# Altium project WUT-4-3-3.PrjPCB
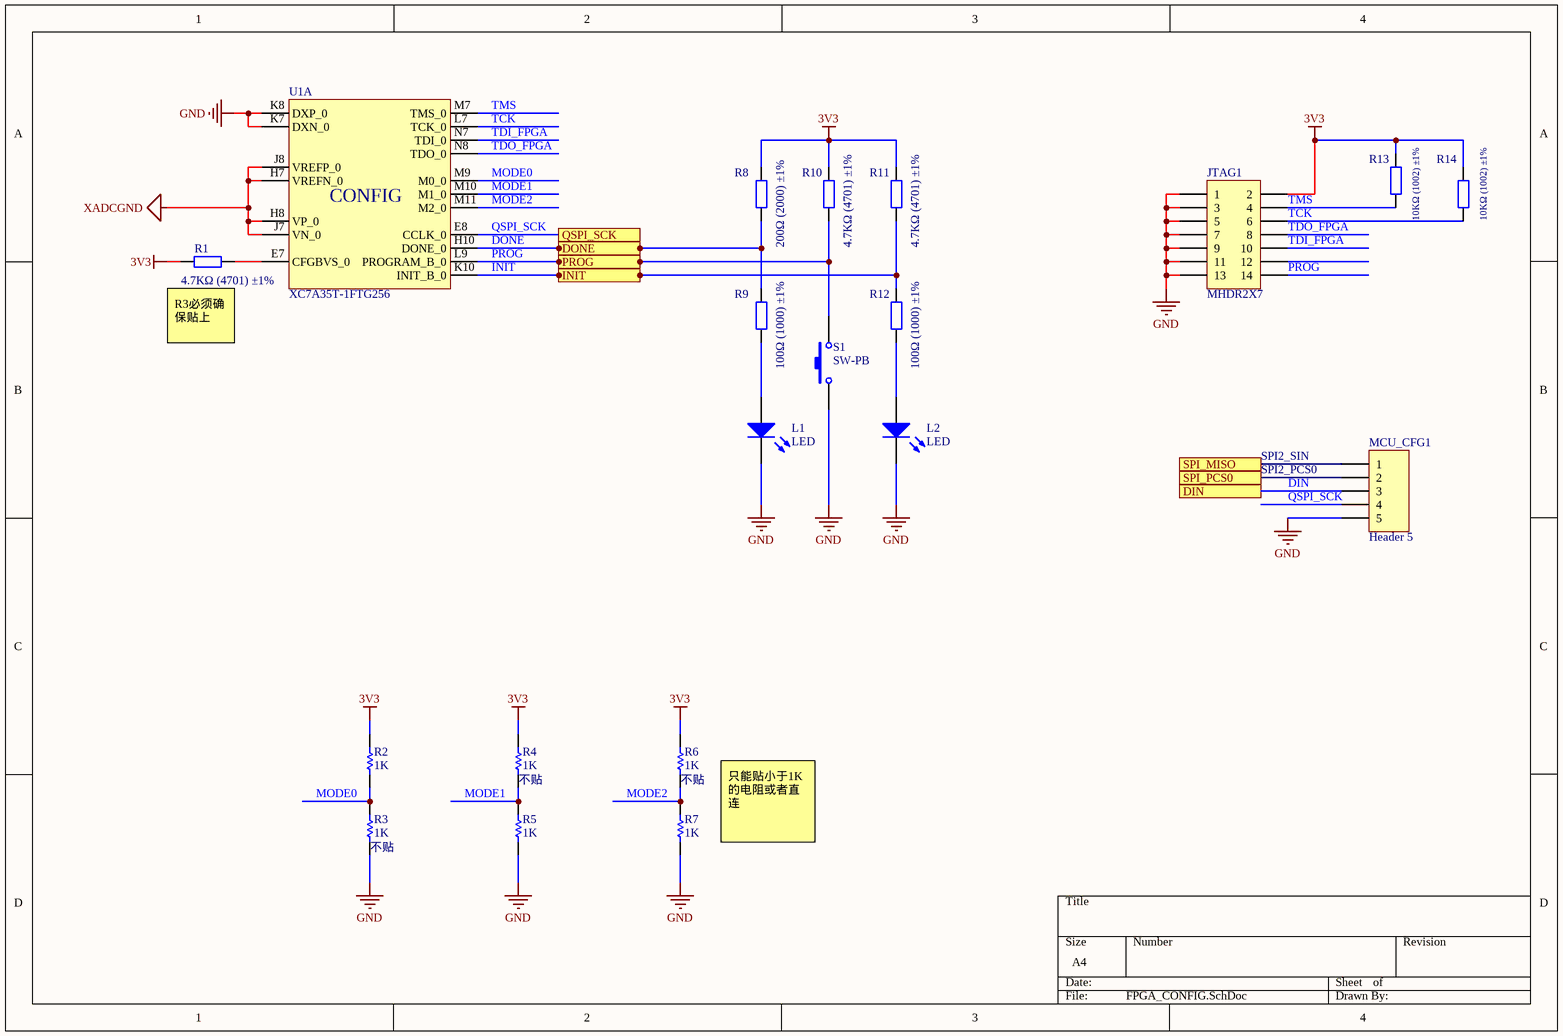
[diagram p0: FPGA_CONFIG.SchDoc]
4 sheets, 143 parts. Net scope: flat (ports and power ports of the same name join across sheets).
Board files: YJ-4-3-2.PcbDoc, WUT-4-3-3.PcbDoc
Sheets:
  FPGA_CONFIG.SchDoc
  GENERAL-IO.SchDoc
  POWER.SchDoc
  FPGA_POWER.SchDoc

## Sheet FPGA_CONFIG.SchDoc
size A4

### Parts
JTAG1  MHDR2X7  [Hearder2 7X2]
L1  LED  [1608[0603]]
L2  LED  [1608[0603]]
MCU_CFG1  Header 5  [MHDR1X5]
R1  4.7KΩ (4701) ±1%  [0402_R]
R2  value 1K  [1608[0603]]  (hidden comment: Res)
R3  不贴  value 1K  [1608[0603]]
R4  不贴  value 1K  [1608[0603]]
R5  value 1K  [1608[0603]]  (hidden comment: Res)
R6  不贴  value 1K  [1608[0603]]
R7  value 1K  [1608[0603]]  (hidden comment: Res)
R8  200Ω (2000) ±1%  [0402_R]
R9  100Ω (1000) ±1%  [0402_R]
R10  4.7KΩ (4701) ±1%  [0402_R]
R11  4.7KΩ (4701) ±1%  [0402_R]
R12  100Ω (1000) ±1%  [0402_R]
R13  10KΩ (1002) ±1%  [0402_R]
R14  10KΩ (1002) ±1%  [0402_R]
S1  SW-PB  [key 3*4*2]
U1  XC7A35T-1FTG256  [BGA100P9X9-81A]  (part A of 7)

### Ports
DIN, DONE, INIT, PROG, QSPI_SCK, SPI_MISO, SPI_PCS0

### Nets
3V3: JTAG1.2 R1.1 R2.2 R4.2 R6.2 R8.2 R10.2 R11.2 R13.2 R14.2
GND: JTAG1.1 JTAG1.3 JTAG1.5 JTAG1.7 JTAG1.9 JTAG1.11 JTAG1.13 L1.2(K) L2.2(K) MCU_CFG1.5 R3.1 R5.1 R7.1 S1.1 U1.K7(DXN_0) U1.K8(DXP_0)
XADCGND: U1.H7(VREFN_0) U1.H8(VP_0) U1.J7(VN_0) U1.J8(VREFP_0)
DIN: MCU_CFG1.3 ; port DIN
DONE: R8.1 R9.2 U1.H10(DONE_0) ; port DONE
INIT: R11.1 R12.2 U1.K10(INIT_B_0) ; port INIT
MODE0: R2.1 R3.2 U1.M9(M0_0)
MODE1: R4.1 R5.2 U1.M10(M1_0)
MODE2: R6.1 R7.2 U1.M11(M2_0)
PROG: JTAG1.14 R10.1 S1.2 U1.L9(PROGRAM_B_0) ; port PROG
QSPI_SCK: MCU_CFG1.4 U1.E8(CCLK_0) ; port QSPI_SCK
SPI2_PCS0: MCU_CFG1.2 ; port SPI_PCS0
SPI2_SIN: MCU_CFG1.1 ; port SPI_MISO
TCK: JTAG1.6 R14.1 U1.L7(TCK_0)
TDI_FPGA: JTAG1.10 U1.N7(TDI_0)
TDO_FPGA: JTAG1.8 U1.N8(TDO_0)
TMS: JTAG1.4 R13.1 U1.M7(TMS_0)
NetL1_1: L1.1(A) R9.1
NetL2_1: L2.1(A) R12.1
NetR1_2: R1.2 U1.E7(CFGBVS_0)

Not connected (* = marked no-connect by the designer): JTAG1 12

### Notes on the sheet
- (near R1) R3必须确保贴上
- 只能贴小于1K的电阻或者直连
- (in symbol XC7A35T-1FTG256, part A) CONFIG

### Library data of the parts
JTAG1 = MHDR2X7: Header, 7-Pin, Dual row; LatestRevisionDate: 17-Jul-2002; LatestRevisionNote: Re-released for DXP Platform.; Publisher: Altium Limited
MCU_CFG1 = Header 5: Header, 5-Pin; LatestRevisionDate: 17-Jul-2002; LatestRevisionNote: Re-released for DXP Platform.; Publisher: Altium Limited
R1 R10 R11 = 0402 4.7KΩ (4701) 1%: 贴片电阻; ComponentLink1Description: 供应商链接; ComponentLink1URL: http://www.szlcsc.com/product/details_26643.html; Package: 0402; Supplier: LC; SuppliersPartNumber: C25900
R2-R7 = Res: 贴片电阻; Published: 8-Jun-2000; LatestRevisionDate: 17-Jul-2002; LatestRevisionNote: Re-released for DXP Platform.; PackageReference: AXIAL-0.3; Publisher: Altium Limited
R8 = 0402 200Ω (2000) 1%: 贴片电阻; ComponentLink1Description: 供应商链接; ComponentLink1URL: http://www.szlcsc.com/product/details_25830.html; Package: 0402; Supplier: LC; SuppliersPartNumber: C25087
R9 R12 = 0402 100Ω (1000) 1%: 贴片电阻; ComponentLink1Description: 供应商链接; ComponentLink1URL: http://www.szlcsc.com/product/details_25819.html; Package: 0402; Supplier: LC; SuppliersPartNumber: C25076
R13 R14 = 0402 10KΩ (1002) 1%: 贴片电阻; ComponentLink1Description: 供应商链接; ComponentLink1URL: http://www.szlcsc.com/product/details_26487.html; Package: 0402; Supplier: LC; SuppliersPartNumber: C25744
S1 = SW-PB: Switch; Published: 24-Mar-1999; LatestRevisionDate: 17-Jul-2002; LatestRevisionNote: Re-released for DXP Platform.; PackageReference: SPST-2; Publisher: Altium Limited; PackageDescription: Switch; 2 Leads

## Sheet GENERAL-IO.SchDoc
size A3
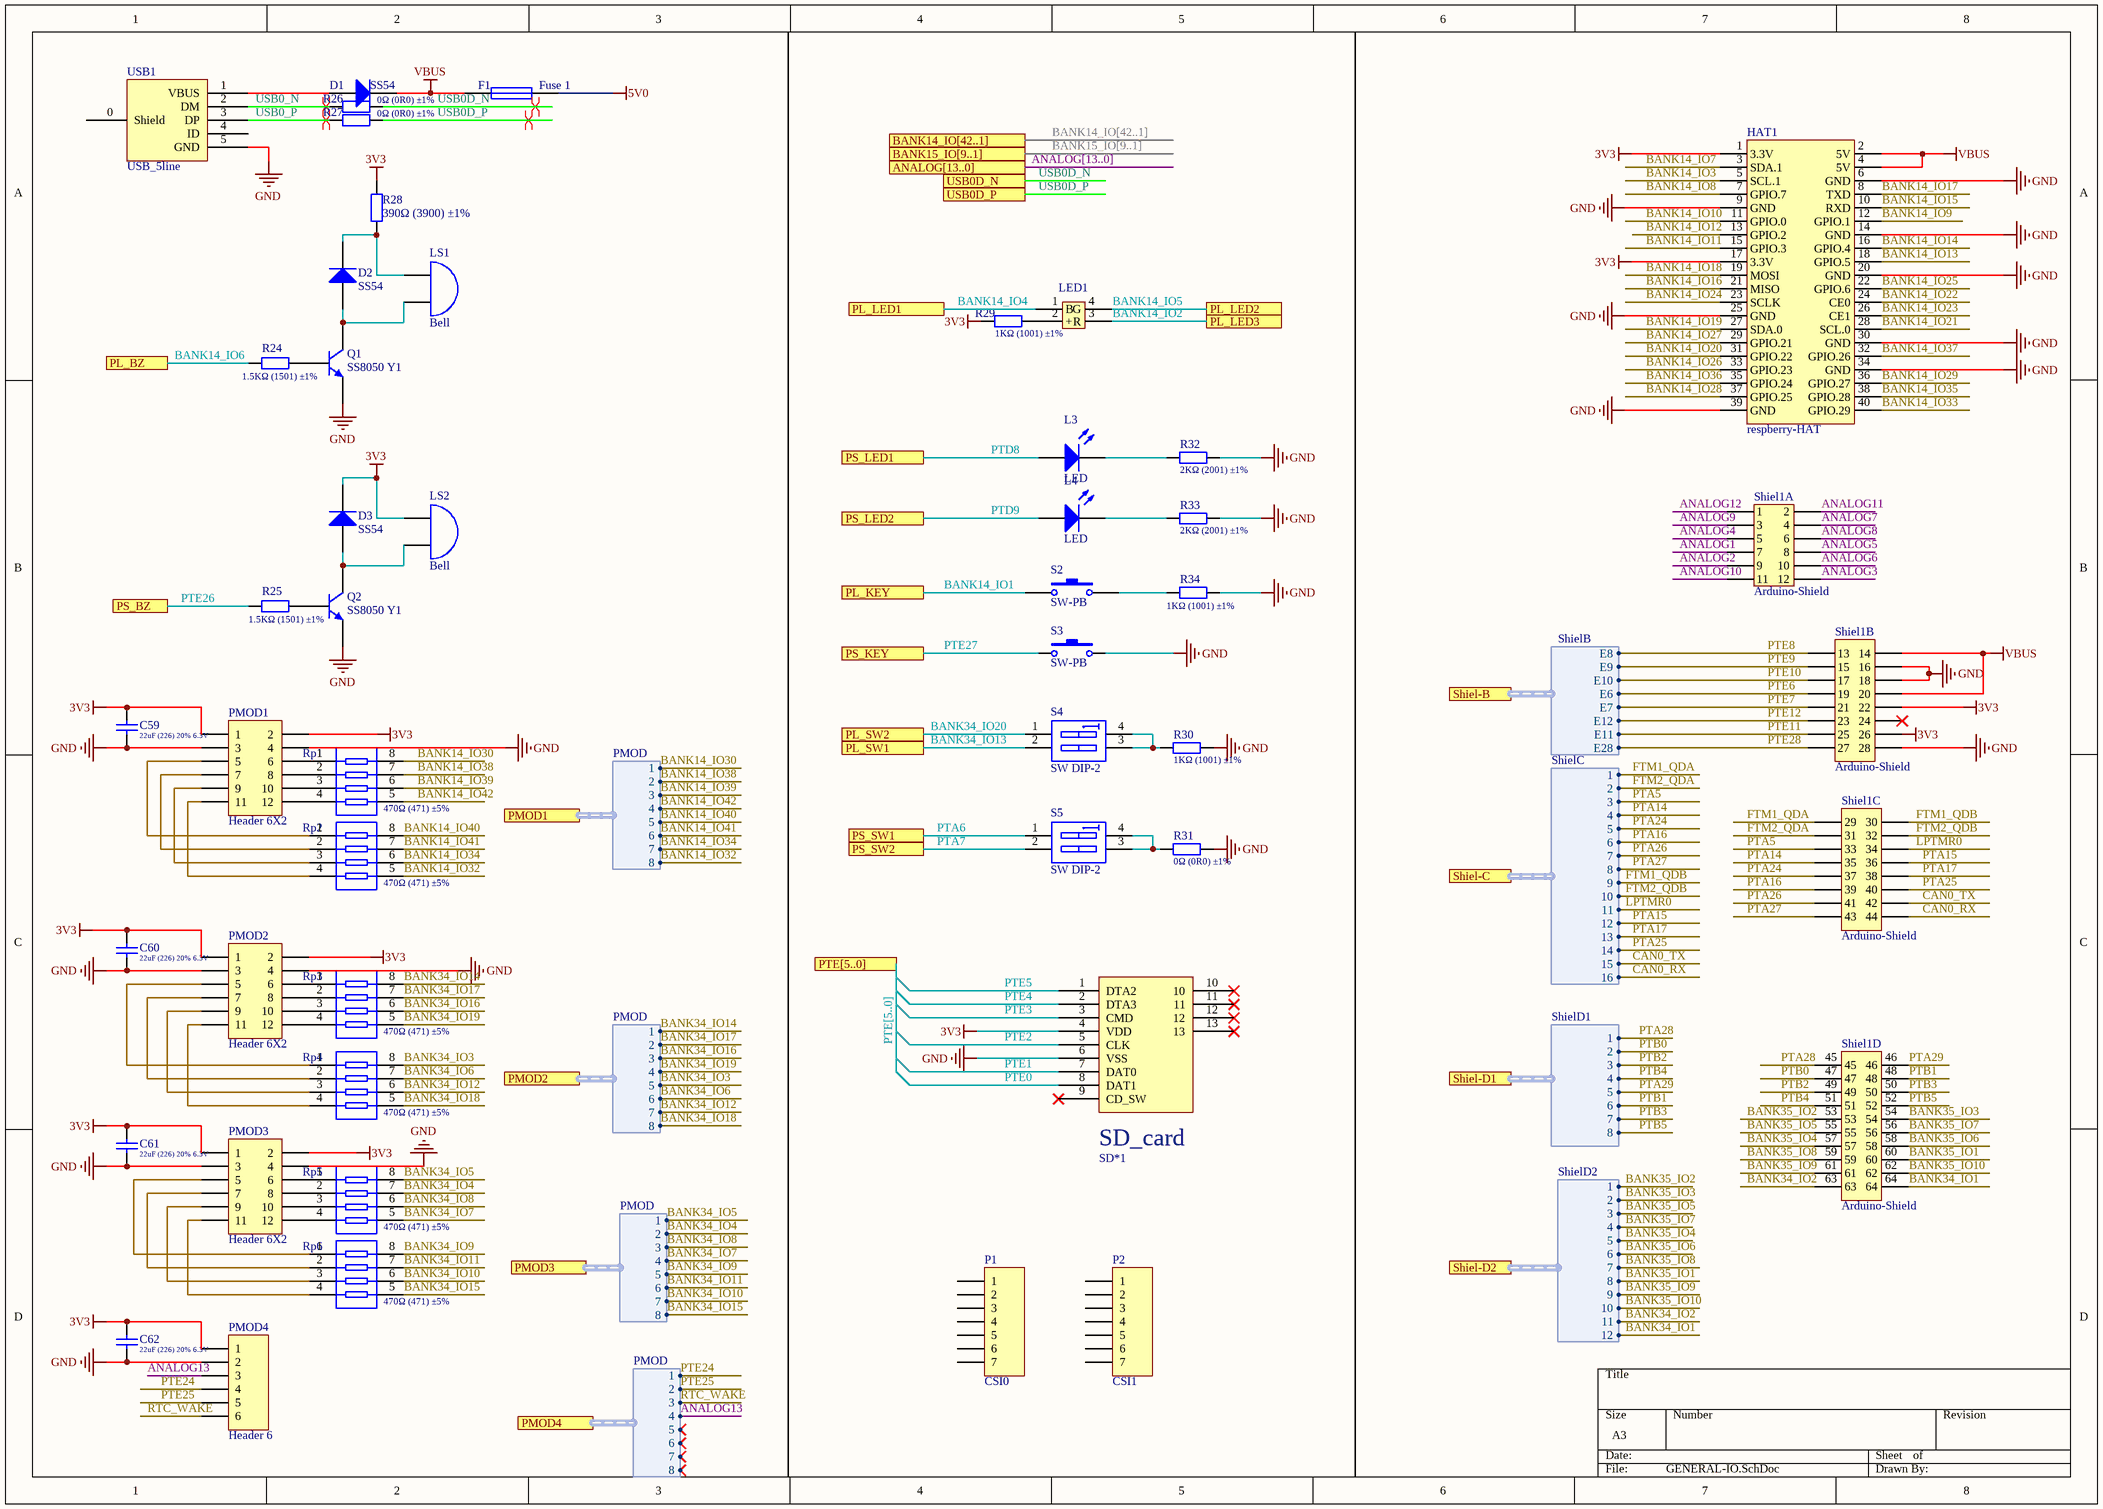
[diagram p1: GENERAL-IO.SchDoc]

### Parts
(Parts that share a designator on the sheet are numbered #1, #2 ... from top to bottom, then left to right.)
C59#1  22uF (226) 20% 6.3V  [0603_C]
C60#1  22uF (226) 20% 6.3V  [0603_C]
C61#1  22uF (226) 20% 6.3V  [0603_C]
C62  22uF (226) 20% 6.3V  [0603_C]
D1  SS54  [SMA(DO-214AC)_S1]
D2  SS54  [SMA(DO-214AC)_S1]
D3#1  SS54  [SMA(DO-214AC)_S1]
F1  Fuse 1  [1206]
HAT1  respberry-HAT  [SMT-HAT]
L3#1  LED  [1608[0603]]
L4#1  LED  [1608[0603]]
LED1  RGB_LED1206  [RGB]  (value not drawn)
LS1  Bell  [MLT-5020 BZ]
LS2  Bell  [BZ]
P1  CSI0
P2  CSI1
PMOD1  Header 6X2  [HDR2X6]
PMOD2  Header 6X2  [HDR2X6]
PMOD3  Header 6X2  [HDR2X6]
PMOD4  Header 6  [HDR1X6]
Q1  SS8050 Y1  [SOT-23(SOT-23-3)]
Q2  SS8050 Y1  [SOT-23(SOT-23-3)]
R24  1.5KΩ (1501) ±1%  [0402_R]
R25  1.5KΩ (1501) ±1%  [0402_R]
R26  0Ω (0R0) ±1%  [0402_R]
R27  0Ω (0R0) ±1%  [0402_R]
R28  390Ω (3900) ±1%  [0805_R]
R29#1  1KΩ (1001) ±1%  [0402_R]
R30#1  1KΩ (1001) ±1%  [0402_R]
R31#1  0Ω (0R0) ±1%  [0402_R]
R32#1  2KΩ (2001) ±1%  [0402_R]
R33#1  2KΩ (2001) ±1%  [0402_R]
R34#1  1KΩ (1001) ±1%  [0402_R]
Rp1  470Ω (471) ±5%  [0603_Rx4]
Rp2  470Ω (471) ±5%  [0603_Rx4]
Rp3  470Ω (471) ±5%  [0603_Rx4]
Rp4  470Ω (471) ±5%  [0603_Rx4]
Rp5  470Ω (471) ±5%  [0603_Rx4]
Rp6  470Ω (471) ±5%  [0603_Rx4]
S2  SW-PB  [key 3*4*2]
S3  SW-PB  [key 3*4*2]
S4  SW DIP-2  [sw*2]
S5  SW DIP-2  [sw*2]
SD*1  TF_card  [TF卡座(短体)]  (value not drawn)
Shiel1  Arduino-Shield  [SMT-B-Shield]  (parts A,B,C,D of 4)
USB1  USB_5line  [USB-MICRO-5P-2F]

### Ports
ANALOG[13..0] (harness Flexbus), BANK14_IO[42..1], BANK15_IO[9..1], PL_BZ, PL_KEY, PL_LED1, PL_LED2, PL_LED3, PL_SW1, PL_SW2, PMOD1 (harness PMOD), PMOD2 (harness PMOD), PMOD3 (harness PMOD), PMOD4 (harness PMOD), PS_BZ, PS_KEY, PS_LED1, PS_LED2, PS_SW1, PS_SW2, PTE[5..0], Shiel-B (harness ShielB), Shiel-C (harness ShielC), Shiel-D1 (harness ShielD1), Shiel-D2 (harness ShielD2), USB0D_N, USB0D_P

### Harnesses
ShielB: E8, E9, E10, E6, E7, E12, E11, E28
PMOD: 1, 2, 3, 4, 5, 6, 7, 8
ShielC: 1, 2, 3, 4, 5, 6, 7, 8, 9, 10, 11, 12, 13, 14, 15, 16
ShielD1: 1, 2, 3, 4, 5, 6, 7, 8
ShielD2: 1, 2, 3, 4, 5, 6, 7, 8, 9, 10, 11, 12

### Nets
3V3: C59#1.2 C60#1.2 C61#1.2 C62.2 D3#1.2(K) HAT1.1(3.3V) HAT1.17(3.3V) LS2.1(A) PMOD1.1 PMOD1.2 PMOD2.1 PMOD2.2 PMOD3.1 PMOD3.2 PMOD4.1 R28.2 R29#1.1 SD*1.4(VDD) Shiel1.22 Shiel1.26
5V0: F1.1
GND: C59#1.1 C60#1.1 C61#1.1 C62.1 HAT1.6(GND) HAT1.9(GND) HAT1.14(GND) HAT1.20(GND) HAT1.25(GND) HAT1.30(GND) HAT1.34(GND) HAT1.39(GND) PMOD1.3 PMOD1.4 PMOD2.3 PMOD2.4 PMOD3.3 PMOD3.4 PMOD4.2 Q1.2(E) Q2.2(E) R30#1.2 R31#1.2 R32#1.2 R33#1.2 R34#1.2 S3.2 SD*1.6(VSS) Shiel1.16 Shiel1.18 Shiel1.28 USB1.5(GND)
VBUS: D1.2(K) F1.2 HAT1.2(5V) HAT1.4(5V) Shiel1.14 Shiel1.20
ANALOG1: Shiel1.7
ANALOG2: Shiel1.9
ANALOG3: Shiel1.12
ANALOG4: Shiel1.5
ANALOG5: Shiel1.8
ANALOG6: Shiel1.10
ANALOG7: Shiel1.4
ANALOG8: Shiel1.6
ANALOG9: Shiel1.3
ANALOG10: Shiel1.11
ANALOG11: Shiel1.2
ANALOG12: Shiel1.1
ANALOG13: PMOD4.3 ; port PMOD4.4
BANK14_IO1: S2.1 ; port PL_KEY
BANK14_IO2: LED1.3(R) ; port PL_LED3
BANK14_IO3: HAT1.5(SCL.1)
BANK14_IO4: LED1.1(B) ; port PL_LED1
BANK14_IO5: LED1.4(G) ; port PL_LED2
BANK14_IO6: R24.1 ; port PL_BZ
BANK14_IO7: HAT1.3(SDA.1)
BANK14_IO8: HAT1.7(GPIO.7)
BANK14_IO9: HAT1.12(GPIO.1)
BANK14_IO10: HAT1.11(GPIO.0)
BANK14_IO11: HAT1.15(GPIO.3)
BANK14_IO12: HAT1.13(GPIO.2)
BANK14_IO13: HAT1.18(GPIO.5)
BANK14_IO14: HAT1.16(GPIO.4)
BANK14_IO15: HAT1.10(RXD)
BANK14_IO16: HAT1.21(MISO)
BANK14_IO17: HAT1.8(TXD)
BANK14_IO18: HAT1.19(MOSI)
BANK14_IO19: HAT1.27(SDA.0)
BANK14_IO20: HAT1.31(GPIO.22)
BANK14_IO21: HAT1.28(SCL.0)
BANK14_IO22: HAT1.24(CE0)
BANK14_IO23: HAT1.26(CE1)
BANK14_IO24: HAT1.23(SCLK)
BANK14_IO25: HAT1.22(GPIO.6)
BANK14_IO26: HAT1.33(GPIO.23)
BANK14_IO27: HAT1.29(GPIO.21)
BANK14_IO28: HAT1.37(GPIO.25)
BANK14_IO29: HAT1.36(GPIO.27)
BANK14_IO30: Rp1.8 ; port PMOD1.1
BANK14_IO32: Rp2.5 ; port PMOD1.8
BANK14_IO33: HAT1.40(GPIO.29)
BANK14_IO34: Rp2.6 ; port PMOD1.7
BANK14_IO35: HAT1.38(GPIO.28)
BANK14_IO36: HAT1.35(GPIO.24)
BANK14_IO37: HAT1.32(GPIO.26)
BANK14_IO38: Rp1.7 ; port PMOD1.2
BANK14_IO39: Rp1.6 ; port PMOD1.3
BANK14_IO40: Rp2.8 ; port PMOD1.5
BANK14_IO41: Rp2.7 ; port PMOD1.6
BANK14_IO42: Rp1.5 ; port PMOD1.4
BANK34_IO1: Shiel1.64 ; port Shiel-D2.12
BANK34_IO2: Shiel1.63 ; port Shiel-D2.11
BANK34_IO3: Rp4.8 ; port PMOD2.5
BANK34_IO4: Rp5.7 ; port PMOD3.2
BANK34_IO5: Rp5.8 ; port PMOD3.1
BANK34_IO6: Rp4.7 ; port PMOD2.6
BANK34_IO7: Rp5.5 ; port PMOD3.4
BANK34_IO8: Rp5.6 ; port PMOD3.3
BANK34_IO9: Rp6.8 ; port PMOD3.5
BANK34_IO10: Rp6.6 ; port PMOD3.7
BANK34_IO11: Rp6.7 ; port PMOD3.6
BANK34_IO12: Rp4.6 ; port PMOD2.7
BANK34_IO13: S4.2(A2) ; port PL_SW1
BANK34_IO14: Rp3.8 ; port PMOD2.1
BANK34_IO15: Rp6.5 ; port PMOD3.8
BANK34_IO16: Rp3.6 ; port PMOD2.3
BANK34_IO17: Rp3.7 ; port PMOD2.2
BANK34_IO18: Rp4.5 ; port PMOD2.8
BANK34_IO19: Rp3.5 ; port PMOD2.4
BANK34_IO20: S4.1(A1) ; port PL_SW2
BANK35_IO1: Shiel1.60 ; port Shiel-D2.8
BANK35_IO2: Shiel1.53 ; port Shiel-D2.1
BANK35_IO3: Shiel1.54 ; port Shiel-D2.2
BANK35_IO4: Shiel1.57 ; port Shiel-D2.5
BANK35_IO5: Shiel1.55 ; port Shiel-D2.3
BANK35_IO6: Shiel1.58 ; port Shiel-D2.6
BANK35_IO7: Shiel1.56 ; port Shiel-D2.4
BANK35_IO8: Shiel1.59 ; port Shiel-D2.7
BANK35_IO9: Shiel1.61 ; port Shiel-D2.9
BANK35_IO10: Shiel1.62 ; port Shiel-D2.10
CAN0_RX: Shiel1.44 ; port Shiel-C.16
CAN0_TX: Shiel1.42 ; port Shiel-C.15
FTM1_QDA: Shiel1.29 ; port Shiel-C.1
FTM1_QDB: Shiel1.30 ; port Shiel-C.9
FTM2_QDA: Shiel1.31 ; port Shiel-C.2
FTM2_QDB: Shiel1.32 ; port Shiel-C.10
LPTMR0: Shiel1.34 ; port Shiel-C.11
PTA5: Shiel1.33 ; port Shiel-C.3
PTA6: S5.1(A1) ; port PS_SW1
PTA7: S5.2(A2) ; port PS_SW2
PTA14: Shiel1.35 ; port Shiel-C.4
PTA15: Shiel1.36 ; port Shiel-C.12
PTA16: Shiel1.39 ; port Shiel-C.6
PTA17: Shiel1.38 ; port Shiel-C.13
PTA24: Shiel1.37 ; port Shiel-C.5
PTA25: Shiel1.40 ; port Shiel-C.14
PTA26: Shiel1.41 ; port Shiel-C.7
PTA27: Shiel1.43 ; port Shiel-C.8
PTA28: Shiel1.45 ; port Shiel-D1.1
PTA29: Shiel1.46 ; port Shiel-D1.5
PTB0: Shiel1.47 ; port Shiel-D1.2
PTB1: Shiel1.48 ; port Shiel-D1.6
PTB2: Shiel1.49 ; port Shiel-D1.3
PTB3: Shiel1.50 ; port Shiel-D1.7
PTB4: Shiel1.51 ; port Shiel-D1.4
PTB5: Shiel1.52 ; port Shiel-D1.8
PTD8: L3#1.1(A) ; port PS_LED1
PTD9: L4#1.1(A) ; port PS_LED2
PTE0: SD*1.8(DAT1)
PTE1: SD*1.7(DAT0)
PTE2: SD*1.5(CLK)
PTE3: SD*1.3(CMD)
PTE4: SD*1.2(DTA3)
PTE5: SD*1.1(DTA2)
PTE6: Shiel1.19 ; port Shiel-B.E6
PTE7: Shiel1.21 ; port Shiel-B.E7
PTE8: Shiel1.13 ; port Shiel-B.E8
PTE9: Shiel1.15 ; port Shiel-B.E9
PTE10: Shiel1.17 ; port Shiel-B.E10
PTE11: Shiel1.25 ; port Shiel-B.E11
PTE12: Shiel1.23 ; port Shiel-B.E12
PTE24: PMOD4.4 ; port PMOD4.1
PTE25: PMOD4.5 ; port PMOD4.2
PTE26: R25.1 ; port PS_BZ
PTE27: S3.1 ; port PS_KEY
PTE28: Shiel1.27 ; port Shiel-B.E28
RTC_WAKE: PMOD4.6 ; port PMOD4.3
USB0_N: R26.1 USB1.2(DM)
USB0_P: R27.1 USB1.3(DP)
USB0D_N: R26.2 ; port USB0D_N
USB0D_P: R27.2 ; port USB0D_P
NetD1_1: D1.1(A) USB1.1(VBUS)
NetD2_1: D2.1(A) LS1.2(B) Q1.3(C)
NetD2_2: D2.2(K) LS1.1(A) R28.1
NetD3#1_1: D3#1.1(A) LS2.2(B) Q2.3(C)
NetL3#1_2: L3#1.2(K) R32#1.1
NetL4#1_2: L4#1.2(K) R33#1.1
NetLED1_2: LED1.2(+) R29#1.2
NetPMOD1_5: PMOD1.5 Rp2.1
NetPMOD1_6: PMOD1.6 Rp1.1
NetPMOD1_7: PMOD1.7 Rp2.2
NetPMOD1_8: PMOD1.8 Rp1.2
NetPMOD1_9: PMOD1.9 Rp2.3
NetPMOD1_10: PMOD1.10 Rp1.3
NetPMOD1_11: PMOD1.11 Rp2.4
NetPMOD1_12: PMOD1.12 Rp1.4
NetPMOD2_5: PMOD2.5 Rp4.1
NetPMOD2_6: PMOD2.6 Rp3.1
NetPMOD2_7: PMOD2.7 Rp4.2
NetPMOD2_8: PMOD2.8 Rp3.2
NetPMOD2_9: PMOD2.9 Rp4.3
NetPMOD2_10: PMOD2.10 Rp3.3
NetPMOD2_11: PMOD2.11 Rp4.4
NetPMOD2_12: PMOD2.12 Rp3.4
NetPMOD3_5: PMOD3.5 Rp6.1
NetPMOD3_6: PMOD3.6 Rp5.1
NetPMOD3_7: PMOD3.7 Rp6.2
NetPMOD3_8: PMOD3.8 Rp5.2
NetPMOD3_9: PMOD3.9 Rp6.3
NetPMOD3_10: PMOD3.10 Rp5.3
NetPMOD3_11: PMOD3.11 Rp6.4
NetPMOD3_12: PMOD3.12 Rp5.4
NetQ1_1: Q1.1(B) R24.2
NetQ2_1: Q2.1(B) R25.2
NetR30#1_1: R30#1.1 S4.3(B2) S4.4(B1)
NetR31#1_1: R31#1.1 S5.3(B2) S5.4(B1)
NetR34#1_1: R34#1.1 S2.2

Not connected (* = marked no-connect by the designer): P1 1 2 3 4 5 6 7; P2 1 2 3 4 5 6 7; SD*1 9(CD_SW)* 10* 11* 12* 13*; Shiel1 24*; USB1 0(Shield) 4(ID)

### Buses and harness runs
bus ANALOG[13..0]
bus BANK14_IO[42..1] = port BANK14_IO[42..1]
bus BANK15_IO[9..1] = port BANK15_IO[9..1]
bus PTE[5..0] = port PTE[5..0]

### Layout directives
differential pair: USB0_N, USB0_P, USB0D_N, USB0D_P

### Notes on the sheet
- (in symbol TF_card) SD_card

### Library data of the parts
C59#1 C60#1 C61#1 C62 = 0603 22uF (226) 20% 6.3V: 贴片电容; ComponentLink1Description: 供应商链接; ComponentLink1URL: http://www.szlcsc.com/product/details_60514.html; Package: 0603; Supplier: LC; SuppliersPartNumber: C59461
D1 D2 D3#1 = SMA(DO-214AC) SS54: 二极管; ComponentLink1Description: 供应商链接; ComponentLink1URL: http://www.szlcsc.com/product/details_23178.html; Package: SMA(DO-214AC); Supplier: LC; SuppliersPartNumber: C22452
F1 = Fuse 1: Fuse; Published: 8-Jun-2000; LatestRevisionDate: 17-Jul-2002; LatestRevisionNote: Re-released for DXP Platform.; PackageReference: PIN-W2/E2.8; Publisher: Altium Limited; PackageDescription: Thru-Hole; 2 Leads
LS1 LS2 = Bell: Electrical Bell; Published: 24-Mar-1999; LatestRevisionDate: 17-Jul-2002; LatestRevisionNote: Re-released for DXP Platform.; PackageReference: PIN2; Publisher: Altium Limited
P1 P2 = Header 7: Header, 7-Pin; LatestRevisionDate: 17-Jul-2002; LatestRevisionNote: Re-released for DXP Platform.; Publisher: Altium Limited
PMOD1-PMOD3 = Header 6X2: Header, 6-Pin, Dual row; LatestRevisionDate: 17-Jul-2002; LatestRevisionNote: Re-released for DXP Platform.; Publisher: Altium Limited
PMOD4 = Header 6: Header, 6-Pin; LatestRevisionDate: 17-Jul-2002; LatestRevisionNote: Re-released for DXP Platform.; Publisher: Altium Limited
Q1 Q2 = SOT-23 SS8050 Y1: 三极管; ComponentLink1Description: 供应商链接; ComponentLink1URL: http://www.szlcsc.com/product/details_2507.html; Package: SOT-23; Supplier: LC; SuppliersPartNumber: C2150
R24 R25 = 0402 1.5KΩ (1501) 1%: 贴片电阻; ComponentLink1Description: 供应商链接; ComponentLink1URL: http://www.szlcsc.com/product/details_26610.html; Package: 0402; Supplier: LC; SuppliersPartNumber: C25867
R26 R27 R31#1 = 0402 0Ω (0R0) 1%: 贴片电阻; ComponentLink1Description: 供应商链接; ComponentLink1URL: http://www.szlcsc.com/product/details_17853.html; Package: 0402; Supplier: LC; SuppliersPartNumber: C17168
R28 = 0805 390Ω (3900) 1%: 贴片电阻; ComponentLink1Description: 供应商链接; ComponentLink1URL: http://www.szlcsc.com/product/details_18343.html; Package: 0805; Supplier: LC; SuppliersPartNumber: C17655
R29#1 R30#1 R34#1 = 0402 1KΩ (1001) 1%: 贴片电阻; ComponentLink1Description: 供应商链接; ComponentLink1URL: http://www.szlcsc.com/product/details_12256.html; Package: 0402; Supplier: LC; SuppliersPartNumber: C11702
R32#1 R33#1 = 0402 2KΩ (2001) 1%: 贴片电阻; ComponentLink1Description: 供应商链接; ComponentLink1URL: http://www.szlcsc.com/product/details_4516.html; Package: 0402; Supplier: LC; SuppliersPartNumber: C4109
Rp1-Rp6 = 0603*4 470Ω (471) 5%: 贴片排阻; ComponentLink1Description: 供应商链接; ComponentLink1URL: http://www.szlcsc.com/product/details_26253.html; Package: 0603*4; Supplier: LC; SuppliersPartNumber: C25510
S2 S3 = SW-PB: Switch
  S2: Published: 24-Mar-1999; LatestRevisionDate: 17-Jul-2002; LatestRevisionNote: Re-released for DXP Platform.; PackageReference: SPST-2; Publisher: Altium Limited; PackageDescription: Switch; 2 Leads
S4 S5 = SW DIP-2: DIP Switch, 2 Position, SPST; Published: 24-Mar-1999; LatestRevisionDate: 17-Jul-2002; LatestRevisionNote: Re-released for DXP Platform.; PackageReference: DIP-4; Publisher: Altium Limited

## Sheet POWER.SchDoc
size A4
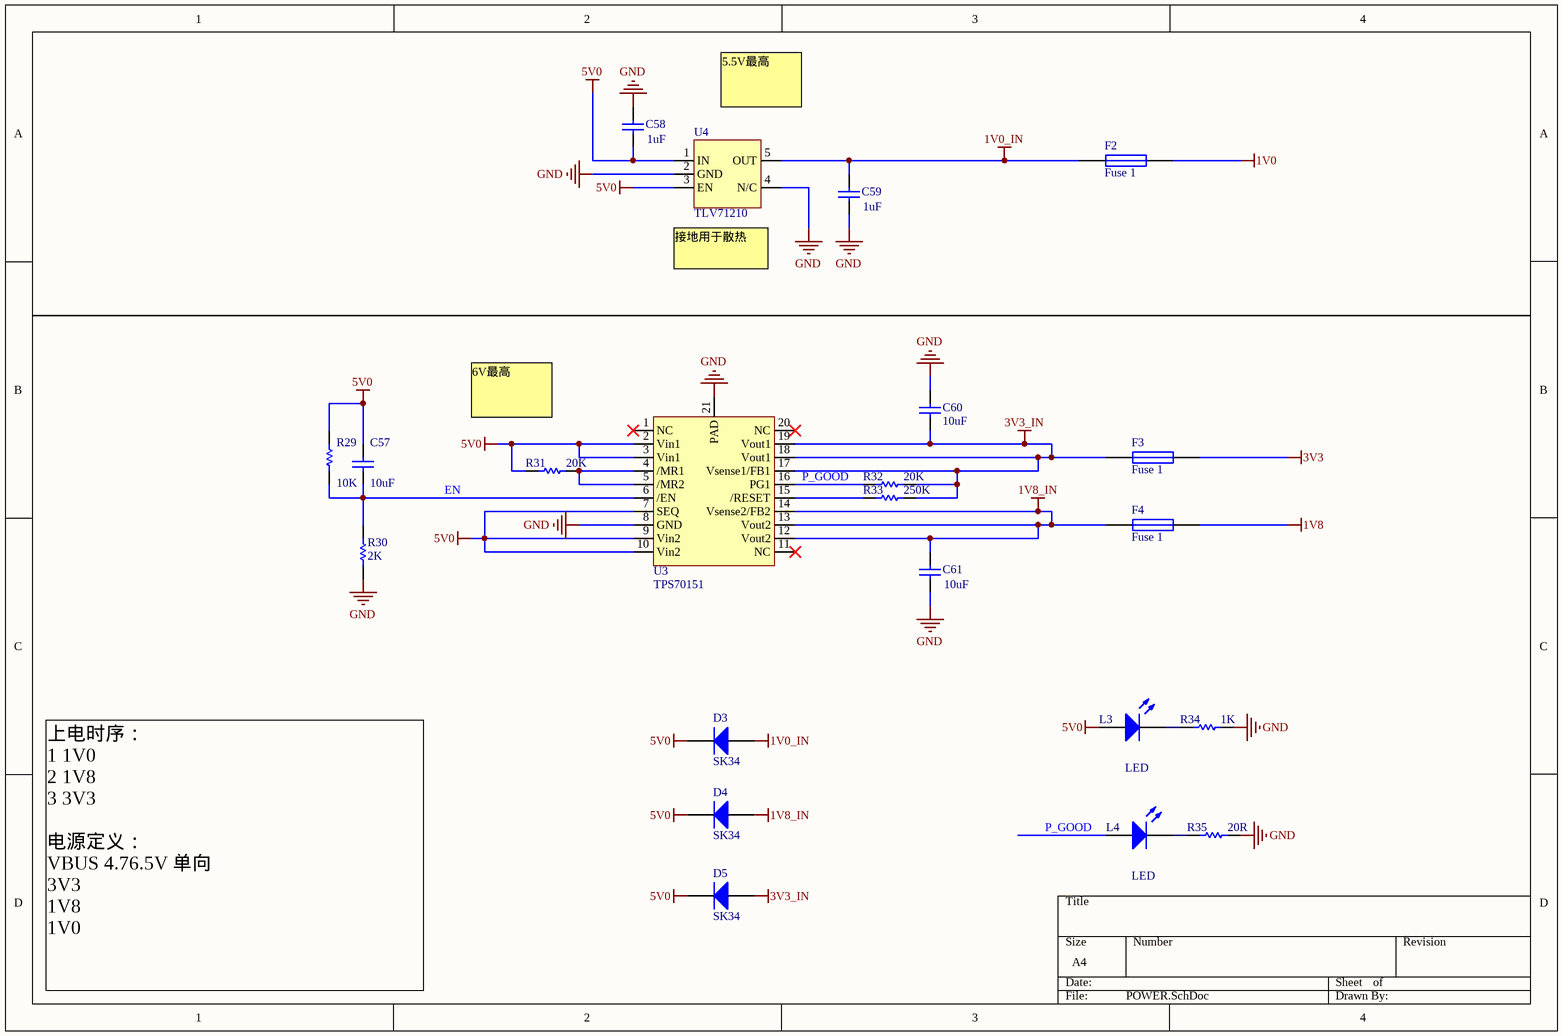
[diagram p2: POWER.SchDoc]

### Parts
(Parts that share a designator on the sheet are numbered #1, #2 ... from top to bottom, then left to right.)
C57  value 10uF  [1608[0603]]  (hidden comment: Cap)
C58  value 1uF  [1608[0603]]  (hidden comment: Cap)
C59#2  value 1uF  [1608[0603]]  (hidden comment: Cap)
C60#2  value 10uF  [1608[0603]]  (hidden comment: Cap)
C61#2  value 10uF  [1608[0603]]  (hidden comment: Cap)
D3#2  SK34  [1206]
D4  SK34  [1206]
D5  SK34  [1206]
F2  Fuse 1  [1206]
F3  Fuse 1  [1206]
F4  Fuse 1  [1206]
L3#2  LED  [1608[0603]]
L4#2  LED  [1608[0603]]
R29#2  value 10K  [1608[0603]]  (hidden comment: Res)
R30#2  value 2K  [1608[0603]]  (hidden comment: Res)
R31#2  value 20K  [1608[0603]]  (hidden comment: Res)
R32#2  value 20K  [1608[0603]]  (hidden comment: Res)
R33#2  value 250K  [1608[0603]]  (hidden comment: Res)
R34#2  value 1K  [1608[0603]]  (hidden comment: Res)
R35  value 20R  [1608[0603]]  (hidden comment: Res)
U3  TPS70151  [TPS701]
U4  TLV71210  [TLV712]

### Nets
1V0: F2.1
1V0_IN: C59#2.1 D3#2.1(A) F2.2 U4.5(OUT)
1V8: F4.1
1V8_IN: C61#2.1 D4.1(A) F4.2 U3.12(Vout2) U3.13(Vout2) U3.14(Vsense2/FB2)
3V3: F3.1
3V3_IN: C60#2.1 D5.1(A) F3.2 R32#2.1 R33#2.1 U3.17(Vsense1/FB1) U3.18(Vout1) U3.19(Vout1)
5V0: C57.1 C58.2 D3#2.2(K) D4.2(K) D5.2(K) L3#2.1(A) R29#2.1 R31#2.2 U3.2(Vin1) U3.3(Vin1) U3.7(SEQ) U3.9(Vin2) U3.10(Vin2) U4.1(IN) U4.3(EN)
GND: C58.1 C59#2.2 C60#2.2 C61#2.2 R30#2.2 R34#2.1 R35.1 U3.8(GND) U3.21(PAD) U4.2(GND) U4.4(N/C)
EN: C57.2 R29#2.2 R30#2.1 U3.6(/EN)
P_GOOD: L4#2.1(A) R32#2.2 U3.16(PG1)
NetL3#2_2: L3#2.2(K) R34#2.2
NetL4#2_2: L4#2.2(K) R35.2
NetR31#2_1: R31#2.1 U3.4(/MR1) U3.5(/MR2)
NetR33#2_2: R33#2.2 U3.15(/RESET)

Not connected (* = marked no-connect by the designer): U3 1(NC)* 11(NC)* 20(NC)*

### Notes on the sheet
- 5.5V最高
- (near U4) 接地用于散热
- 6V最高
- 上电时序：
  1 1V0
  2 1V8
  3 3V3
  电源定义：
  VBUS 4.76.5V 单向
  3V3
  1V8
  1V0

### Library data of the parts
C57 C58 C59#2 C60#2 C61#2 = Cap: 贴片电容; Published: 8-Jun-2000; LatestRevisionDate: 17-Jul-2002; LatestRevisionNote: Re-released for DXP Platform.; PackageReference: RAD-0.3; Publisher: Altium Limited
D3#2 D4 D5 = Diode 1N4148: High Conductance Fast Diode; LatestRevisionDate: 17-Jul-2002; LatestRevisionNote: Re-released for DXP Platform.; DatasheetDocument: 1997; PackageReference: DO-35; Publisher: Altium Limited; Code_JEDEC: DO-204-AH; ComponentLink1Description: Manufacturer Link; ComponentLink2Description: Datasheet; ComponentLink2URL: http://www.fairchildsemi.com/ds/1N%2F1N4148.pdf
F2-F4 = Fuse 1: Fuse; Published: 8-Jun-2000; LatestRevisionDate: 17-Jul-2002; LatestRevisionNote: Re-released for DXP Platform.; PackageReference: PIN-W2/E2.8; Publisher: Altium Limited; PackageDescription: Thru-Hole; 2 Leads
R29#2 R30#2 R31#2 R32#2 R33#2 R34#2 R35 = Res: 贴片电阻; Published: 8-Jun-2000; LatestRevisionDate: 17-Jul-2002; LatestRevisionNote: Re-released for DXP Platform.; PackageReference: AXIAL-0.3; Publisher: Altium Limited
U3 = TPS701
U4 = TLV712

## Sheet FPGA_POWER.SchDoc
size A4
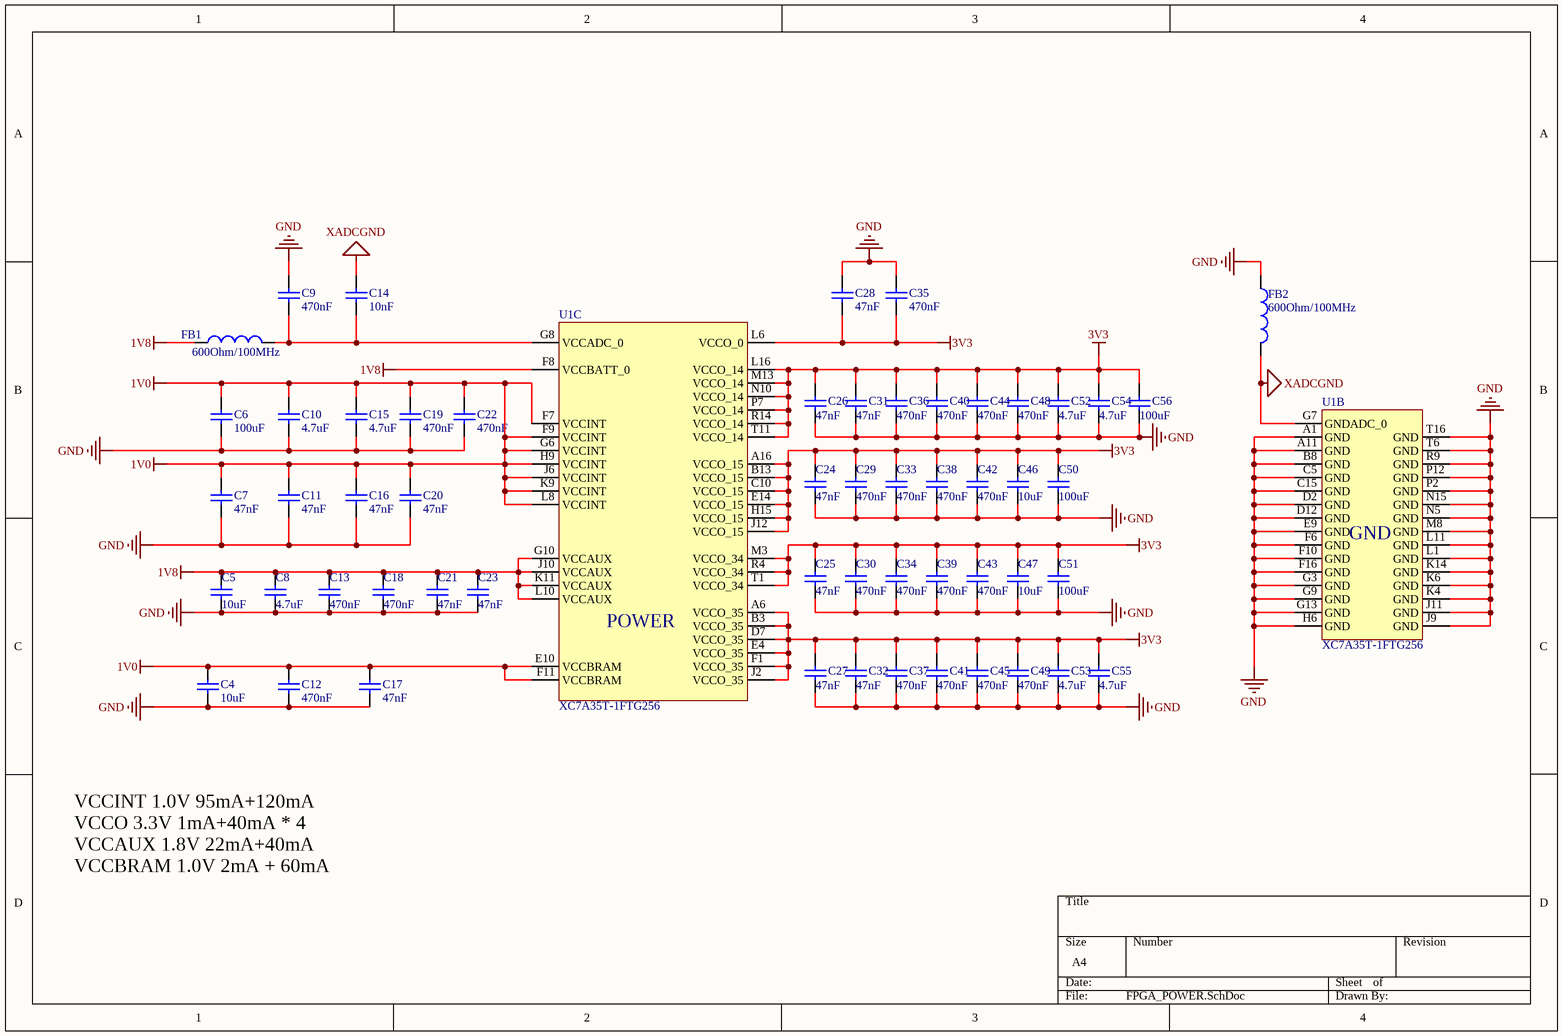
[diagram p3: FPGA_POWER.SchDoc]

### Parts
C4  value 10uF  [0402]  (hidden comment: Cap)
C5  value 10uF  [0402]  (hidden comment: Cap)
C6  value 100uF  [1206]  (hidden comment: Cap)
C7  value 47nF  [0402]  (hidden comment: Cap)
C8  value 4.7uF  [0402]  (hidden comment: Cap)
C9  value 470nF  [0402]  (hidden comment: Cap)
C10  value 4.7uF  [0402]  (hidden comment: Cap)
C11  value 47nF  [0402]  (hidden comment: Cap)
C12  value 470nF  [0402]  (hidden comment: Cap)
C13  value 470nF  [0402]  (hidden comment: Cap)
C14  value 10nF  [0402]  (hidden comment: Cap)
C15  value 4.7uF  [0402]  (hidden comment: Cap)
C16  value 47nF  [0402]  (hidden comment: Cap)
C17  value 47nF  [0402]  (hidden comment: Cap)
C18  value 470nF  [0402]  (hidden comment: Cap)
C19  value 470nF  [0402]  (hidden comment: Cap)
C20  value 47nF  [0402]  (hidden comment: Cap)
C21  value 47nF  [0402]  (hidden comment: Cap)
C22  value 470nF  [0402]  (hidden comment: Cap)
C23  value 47nF  [0402]  (hidden comment: Cap)
C24  value 47nF  [0402]  (hidden comment: Cap)
C25  value 47nF  [0402]  (hidden comment: Cap)
C26  value 47nF  [0402]  (hidden comment: Cap)
C27  value 47nF  [0402]  (hidden comment: Cap)
C28  value 47nF  [0402]  (hidden comment: Cap)
C29  value 470nF  [0402]  (hidden comment: Cap)
C30  value 470nF  [0402]  (hidden comment: Cap)
C31  value 47nF  [0402]  (hidden comment: Cap)
C32  value 47nF  [0402]  (hidden comment: Cap)
C33  value 470nF  [0402]  (hidden comment: Cap)
C34  value 470nF  [0402]  (hidden comment: Cap)
C35  value 470nF  [0402]  (hidden comment: Cap)
C36  value 470nF  [0402]  (hidden comment: Cap)
C37  value 470nF  [0402]  (hidden comment: Cap)
C38  value 470nF  [0402]  (hidden comment: Cap)
C39  value 470nF  [0402]  (hidden comment: Cap)
C40  value 470nF  [0402]  (hidden comment: Cap)
C41  value 470nF  [0402]  (hidden comment: Cap)
C42  value 470nF  [0402]  (hidden comment: Cap)
C43  value 470nF  [0402]  (hidden comment: Cap)
C44  value 470nF  [0402]  (hidden comment: Cap)
C45  value 470nF  [0402]  (hidden comment: Cap)
C46  value 10uF  [0402]  (hidden comment: Cap)
C47  value 10uF  [0402]  (hidden comment: Cap)
C48  value 470nF  [0402]  (hidden comment: Cap)
C49  value 470nF  [0402]  (hidden comment: Cap)
C50  value 100uF  [1206]  (hidden comment: Cap)
C51  value 100uF  [1206]  (hidden comment: Cap)
C52  value 4.7uF  [0402]  (hidden comment: Cap)
C53  value 4.7uF  [0402]  (hidden comment: Cap)
C54  value 4.7uF  [0402]  (hidden comment: Cap)
C55  value 4.7uF  [0402]  (hidden comment: Cap)
C56  value 100uF  [1206]  (hidden comment: Cap)
FB1  value 600Ohm/100MHz  [0402]  (hidden comment: Inductor)
FB2  value 600Ohm/100MHz  [0402]  (hidden comment: Inductor)
U1  XC7A35T-1FTG256  [BGA100P9X9-81A]  (parts B,C of 7)

### Nets
1V0: C4.1 C6.1 C7.1 C10.1 C11.1 C12.1 C15.1 C16.1 C17.1 C19.1 C20.1 C22.1 U1.E10(VCCBRAM) U1.F7(VCCINT) U1.F9(VCCINT) U1.F11(VCCBRAM) U1.G6(VCCINT) U1.H9(VCCINT) U1.J6(VCCINT) U1.K9(VCCINT) U1.L8(VCCINT)
1V8: C5.1 C8.1 C13.1 C18.1 C21.1 C23.1 FB1.1 U1.F8(VCCBATT_0) U1.G10(VCCAUX) U1.J10(VCCAUX) U1.K11(VCCAUX) U1.L10(VCCAUX)
3V3: C24.1 C25.1 C26.1 C27.1 C28.2 C29.1 C30.1 C31.1 C32.1 C33.1 C34.1 C35.2 C36.1 C37.1 C38.1 C39.1 C40.1 C41.1 C42.1 C43.1 C44.1 C45.1 C46.1 C47.1 C48.1 C49.1 C50.1 C51.1 C52.1 C53.1 C54.1 C55.1 C56.1 U1.A6(VCCO_35) U1.A16(VCCO_15) U1.B3(VCCO_35) U1.B13(VCCO_15) U1.C10(VCCO_15) U1.D7(VCCO_35) U1.E4(VCCO_35) U1.E14(VCCO_15) U1.F1(VCCO_35) U1.H15(VCCO_15) U1.J2(VCCO_35) U1.J12(VCCO_15) U1.L6(VCCO_0) U1.L16(VCCO_14) U1.M3(VCCO_34) U1.M13(VCCO_14) U1.N10(VCCO_14) U1.P7(VCCO_14) U1.R4(VCCO_34) U1.R14(VCCO_14) U1.T1(VCCO_34) U1.T11(VCCO_14)
GND: C4.2 C5.2 C6.2 C7.2 C8.2 C9.1 C10.2 C11.2 C12.2 C13.2 C15.2 C16.2 C17.2 C18.2 C19.2 C20.2 C21.2 C22.2 C23.2 C24.2 C25.2 C26.2 C27.2 C28.1 C29.2 C30.2 C31.2 C32.2 C33.2 C34.2 C35.1 C36.2 C37.2 C38.2 C39.2 C40.2 C41.2 C42.2 C43.2 C44.2 C45.2 C46.2 C47.2 C48.2 C49.2 C50.2 C51.2 C52.2 C53.2 C54.2 C55.2 C56.2 FB2.1 U1.A1(GND) U1.A11(GND) U1.B8(GND) U1.C5(GND) U1.C15(GND) U1.D2(GND) U1.D12(GND) U1.E9(GND) U1.F6(GND) U1.F10(GND) U1.F16(GND) U1.G3(GND) U1.G9(GND) U1.G13(GND) U1.H6(GND) U1.J9(GND) U1.J11(GND) U1.K4(GND) U1.K6(GND) U1.K14(GND) U1.L1(GND) U1.L11(GND) U1.M8(GND) U1.N5(GND) U1.N15(GND) U1.P2(GND) U1.P12(GND) U1.R9(GND) U1.T6(GND) U1.T16(GND)
XADCGND: C14.2 FB2.2 U1.G7(GNDADC_0)
NetC9_2: C9.2 C14.1 FB1.2 U1.G8(VCCADC_0)

### Notes on the sheet
- VCCINT 1.0V 95mA+120mA
  VCCO 3.3V 1mA+40mA * 4
  VCCAUX 1.8V 22mA+40mA
  VCCBRAM 1.0V 2mA + 60mA
- (in symbol XC7A35T-1FTG256, part C) POWER

### Library data of the parts
C4-C56 = Cap: 贴片电容; Published: 8-Jun-2000; LatestRevisionDate: 17-Jul-2002; LatestRevisionNote: Re-released for DXP Platform.; PackageReference: RAD-0.3; Publisher: Altium Limited
FB1 FB2 = Inductor: Code_IEC: 1005; Published: 8-Jun-2000; LatestRevisionDate: 29-May-2009; LatestRevisionNote: IPC-7351 Footprint Added.; PackageReference: 0402-A; Publisher: Altium Limited; PackageDescription: Chip Inductor; Code_JEITA: 0402

## Nets that join several sheets
1V0: POWER (F2.1), FPGA_POWER (21 pins)
1V8: POWER (F4.1), FPGA_POWER (12 pins)
3V3: FPGA_CONFIG (10 pins), GENERAL-IO (20 pins), POWER (F3.1), FPGA_POWER (55 pins)
5V0: GENERAL-IO (F1.1), POWER (15 pins)
GND: FPGA_CONFIG (16 pins), GENERAL-IO (32 pins), POWER (11 pins), FPGA_POWER (83 pins)
XADCGND: FPGA_CONFIG (U1.H7 U1.H8 U1.J7 U1.J8), FPGA_POWER (C14.2 FB2.2 U1.G7)